# EAGLE design TinySoc (EAGLE 6.4)

## Sheet 1 of 2
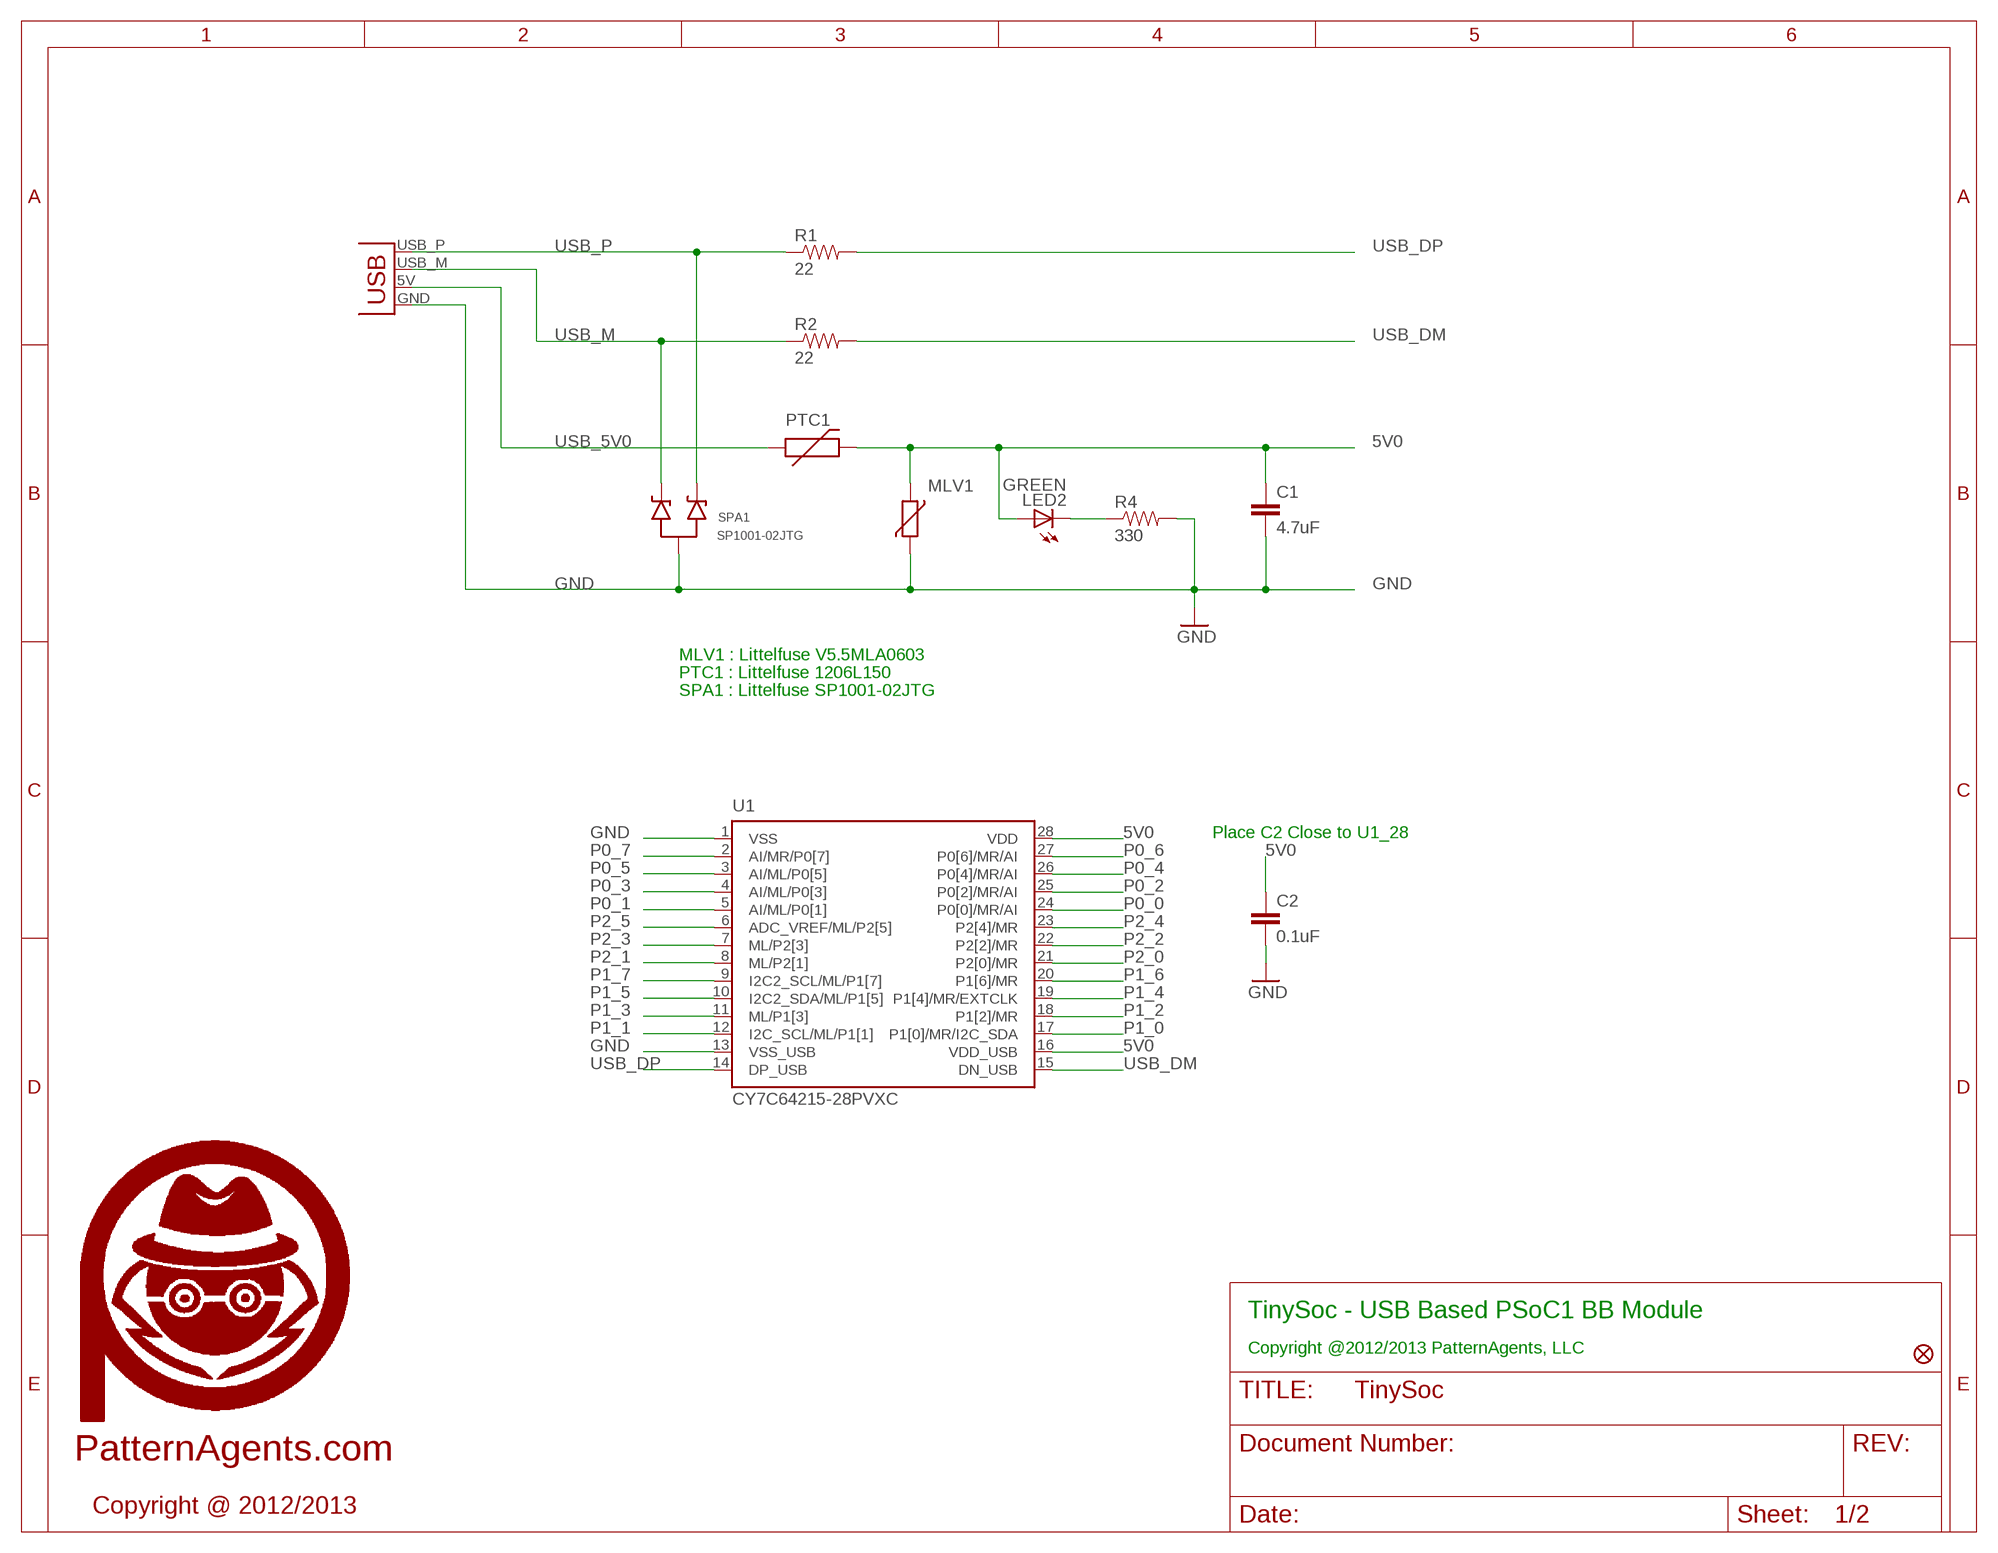
[diagram p0: schematic, sheet 1]

### Parts
C1  4.7uF  CAP0603-CAP  [0603-CAP]
C2  0.1uF  CAP0603-CAP  [0603-CAP]
FID1  FIDUCIAL1.5X3  [FIDUCIAL-1.5X3]
LED2  GREEN  LED0603  [LED-0603]
MLV1  VARISTORCN0603  [CT/CN0603]
PTC1  PTCSMD  [PTC-1206]
R1  22  RESISTOR0603-RES  [0603-RES]
R2  22  RESISTOR0603-RES  [0603-RES]
R4  330  RESISTOR0603-RES  [0603-RES]
SPA1  SP1001-02JTG  [SC70-3]
U1  CY7C64215-28PVXC  [SSOP28]
U$2  PA_LOGO_SYMSMALL  [PA_LOGO_AGENT_SMALL_SYM]
USBPCB  USBPCB  [USB-A-PCB]

### Nets
5V0: C1.1 C2.1 LED2.A MLV1.1 PTC1.2 U1.16(VDD_USB) U1.28(VDD) ; also sheet 2
GND: C1.2 C2.2 MLV1.2 R4.2 SPA1.3(A) U1.1(VSS) U1.13(VSS_USB) USBPCB.GND ; also sheet 2
N$1: LED2.C R4.1
P0_0: U1.24(P0[0]/MR/AI) ; also sheet 2
P0_1: U1.5(AI/ML/P0[1]) ; also sheet 2
P0_2: U1.25(P0[2]/MR/AI) ; also sheet 2
P0_3: U1.4(AI/ML/P0[3]) ; also sheet 2
P0_4: U1.26(P0[4]/MR/AI) ; also sheet 2
P0_5: U1.3(AI/ML/P0[5]) ; also sheet 2
P0_6: U1.27(P0[6]/MR/AI) ; also sheet 2
P0_7: U1.2(AI/MR/P0[7]) ; also sheet 2
P1_0: U1.17(P1[0]/MR/I2C_SDA) ; also sheet 2
P1_1: U1.12(I2C_SCL/ML/P1[1]) ; also sheet 2
P1_2: U1.18(P1[2]/MR) ; also sheet 2
P1_3: U1.11(ML/P1[3]) ; also sheet 2
P1_4: U1.19(P1[4]/MR/EXTCLK) ; also sheet 2
P1_5: U1.10(I2C2_SDA/ML/P1[5]) ; also sheet 2
P1_6: U1.20(P1[6]/MR) ; also sheet 2
P1_7: U1.9(I2C2_SCL/ML/P1[7]) ; also sheet 2
P2_0: U1.21(P2[0]/MR) ; also sheet 2
P2_1: U1.8(ML/P2[1]) ; also sheet 2
P2_2: U1.22(P2[2]/MR) ; also sheet 2
P2_3: U1.7(ML/P2[3]) ; also sheet 2
P2_4: U1.23(P2[4]/MR) ; also sheet 2
P2_5: U1.6(ADC_VREF/ML/P2[5]) ; also sheet 2
USB_5V0 [usbvcc]: PTC1.1 USBPCB.5V(VBUS)
USB_DM: R2.2 U1.15(DN_USB)
USB_DP: R1.2 U1.14(DP_USB)
USB_M: R2.1 SPA1.2(C2) USBPCB.USB_M(D-)
USB_P: R1.1 SPA1.1(C1) USBPCB.USB_P(D+)

### Notes on the sheet
- MLV1 : Littelfuse V5.5MLA0603
- PTC1 : Littelfuse 1206L150
- SPA1 : Littelfuse SP1001-02JTG
- Place C2 Close to U1_28
- TinySoc - USB Based PSoC1 BB Module
- Copyright @2012/2013 PatternAgents, LLC
- PatternAgents.com
- Copyright @ 2012/2013

## Sheet 2 of 2
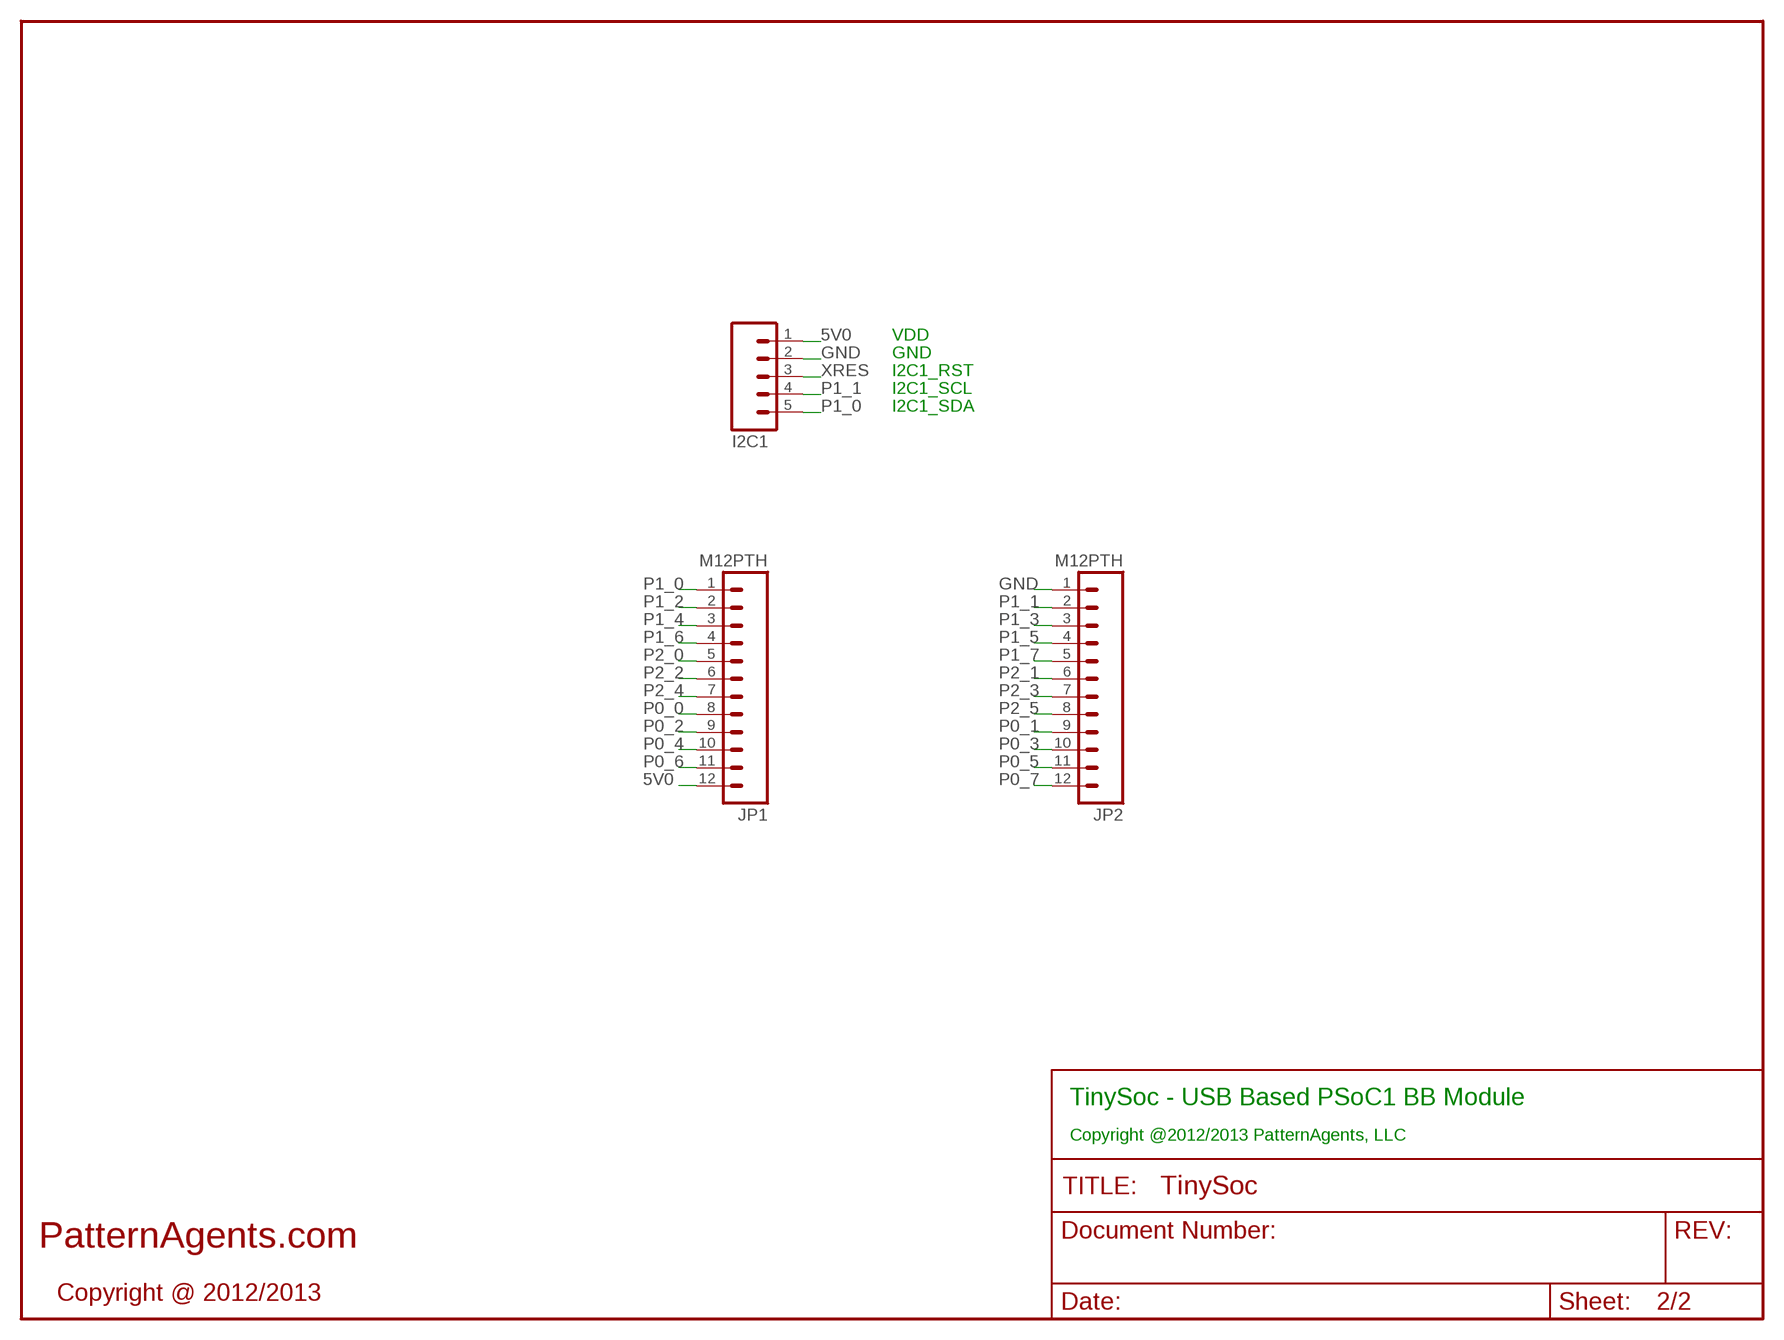
[diagram p1: schematic, sheet 2]

### Parts
I2C1  M05PTH  [1X05]
JP1  M12PTH  [1X12]
JP2  M12PTH  [1X12]

### Nets
5V0: I2C1.1 JP1.12 ; also sheet 1
GND: I2C1.2 JP2.1 ; also sheet 1
P0_0: JP1.8 ; also sheet 1
P0_1: JP2.9 ; also sheet 1
P0_2: JP1.9 ; also sheet 1
P0_3: JP2.10 ; also sheet 1
P0_4: JP1.10 ; also sheet 1
P0_5: JP2.11 ; also sheet 1
P0_6: JP1.11 ; also sheet 1
P0_7: JP2.12 ; also sheet 1
P1_0: I2C1.5 JP1.1 ; also sheet 1
P1_1: I2C1.4 JP2.2 ; also sheet 1
P1_2: JP1.2 ; also sheet 1
P1_3: JP2.3 ; also sheet 1
P1_4: JP1.3 ; also sheet 1
P1_5: JP2.4 ; also sheet 1
P1_6: JP1.4 ; also sheet 1
P1_7: JP2.5 ; also sheet 1
P2_0: JP1.5 ; also sheet 1
P2_1: JP2.6 ; also sheet 1
P2_2: JP1.6 ; also sheet 1
P2_3: JP2.7 ; also sheet 1
P2_4: JP1.7 ; also sheet 1
P2_5: JP2.8 ; also sheet 1
XRES: I2C1.3

### Notes on the sheet
- VDD
- GND
- I2C1_RST
- I2C1_SCL
- I2C1_SDA
- TinySoc - USB Based PSoC1 BB Module
- Copyright @2012/2013 PatternAgents, LLC
- PatternAgents.com
- Copyright @ 2012/2013

## Library data of the parts
C1 C2 = SparkFun:CAP: Capacitor Standard 0603 ceramic capacitor, and 0.1" leaded capacitor.
FID1 = PatternAgents-Misc:FIDUCIAL: Fiducial Alignment Points Various fiducial points for machine vision alignment.
I2C1 = SparkFun:M05: Header 5 Standard 5-pin 0.1" header. Use with straight break away headers (SKU : PRT-00116), right angle break away headers (PRT-00553), swiss pins (PRT-00743), machine pins (PRT-00117), and female headers (PRT-00115). Molex polarized connector foot print use with SKU : PRT-08230 with associated crimp pins and housings.
JP1 JP2 = SparkFun:M12: Header 12 Standard 12-pin 0.1" header. Use with straight break away headers (SKU : PRT-00116), right angle break away headers (PRT-00553), swiss pins (PRT-00743), machine pins (PRT-00117), and female headers (PRT-00115).
LED2 = SparkFun:LED: LEDs Standard schematic elements and footprints for 5mm, 3mm, 1206, and 0603 sized LEDs. 5mm - Spark Fun Electronics SKU : COM-00529 (and others)
MLV1 = moxdes_V1_0:VARISTOR: VARISTOR
PTC1 = moxdes_V1_0:PTC: Resettable Fuse PTC Resettable Fuse. Spark Fun Electronics SKU : COM-08357
R1 R2 R4 = SparkFun:RESISTOR: Resistor Basic schematic elements and footprints for 0603, 1206, and PTH resistors.
SPA1 = moxdes_V1_0:SP1001-02JTG: Littelfuse SP1001-02JTG TVS Diode Array 8pf 15kV Source: http://www.littelfuse.com/data/en/Product_Catalogs/Littelfuse_TVS_Diode_Array_SPA_Catalog.pdf patternshed.com: created 3/25/2012
U1 = moxdes_std:CY7C64215-28PVXC: EZ-USB ENCORE3 28SSOP
U$2 = PatternAgents-Logos:PA_LOGO_SYM: PatternAgents Logo Symbol Trademark : PatternAgents, LLC Github : https://github.com/PatternAgents/PCB_Libraries License : http://creativecommons.org/licenses/by-sa/3.0/ (Creative Commons 3.0) THIS SOFTWARE IS PROVIDED BY THE CONTRIBUTORS "AS IS" AND WITHOUT ANY EXPRESS OR IMPLIED WARRANTIES, INCLUDING, BUT NOT LIMITED TO, THE IMPLIED WARRANTIES OF MERCHANTABILITY AND FITNESS FOR A PARTICULAR PURPOSE ARE DISCLAIMED. IN NO EVENT SHALL THE COPYRIGHT OWNER OR CONTRIBUTORS BE LIABLE FOR ANY DIRECT, INDIRECT, INCIDENTAL, SPECIAL, EXEMPLARY, OR CONSEQUENTIAL DAMAGES (INCLUDING, BUT NOT LIMITED TO, PROCUREMENT OF SUBSTITUTE GOODS OR SERVICES; LOSS OF USE, DATA, OR PROFITS; OR BUSINESS INTERRUPTION) HOWEVER CAUSED AND ON ANY THEORY OF LIABILITY, WHETHER IN CONTRACT, STRICT LIABILITY, OR TORT (INCLUDING NEGLIGENCE OR OTHERWISE) ARISING IN ANY WAY OUT OF THE USE OF THIS SOFTWARE, EVEN IF ADVISED OF THE POSSIBILITY OF SUCH DAMAGE.
USBPCB = SparkFun:USB: USB Connectors USB-B-PTH is fully proven SKU : PRT-00139 USB-miniB is fully proven SKU : PRT-00587 USB-A-PCB is untested. USB-A-H is throughly reviewed, but untested. Spark Fun Electronics SKU : PRT-00437 USB-B-SMT is throughly reviewed, but untested. Needs silkscreen touching up. USB-A-S has not been used/tested USB-MB-H has not been used/tested

## Net classes
0 default: width 0.254 mm, clearance 0.254 mm
1 power: width 0.61 mm, drill 0.61 mm, clearance 0.254 mm
2 gnd: width 0.305 mm, drill 0.559 mm, clearance 0.254 mm
3 usbvcc: width 0.508 mm, drill 0.61 mm, clearance 0.254 mm

## Board
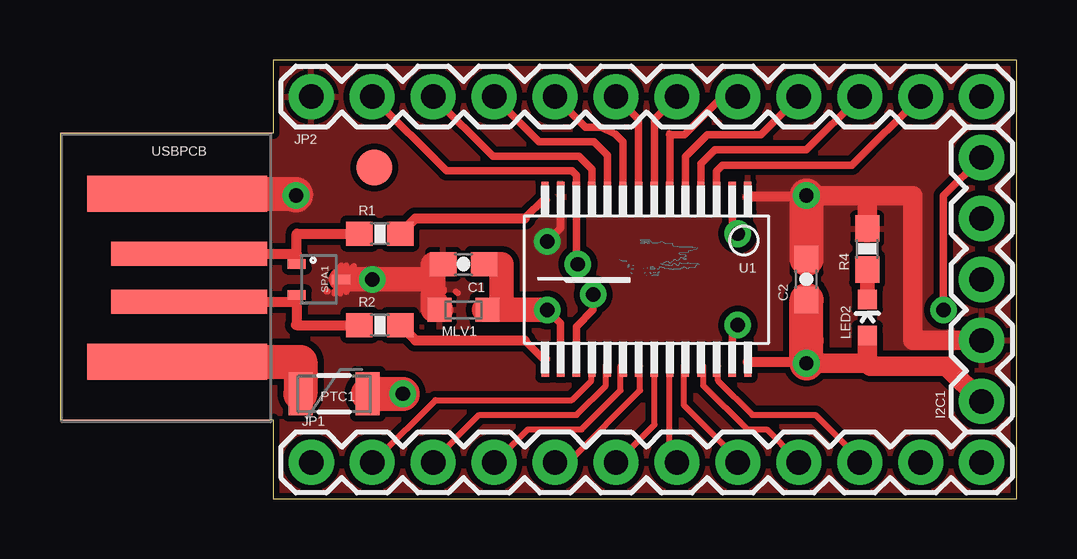
[diagram p2: board, top side]
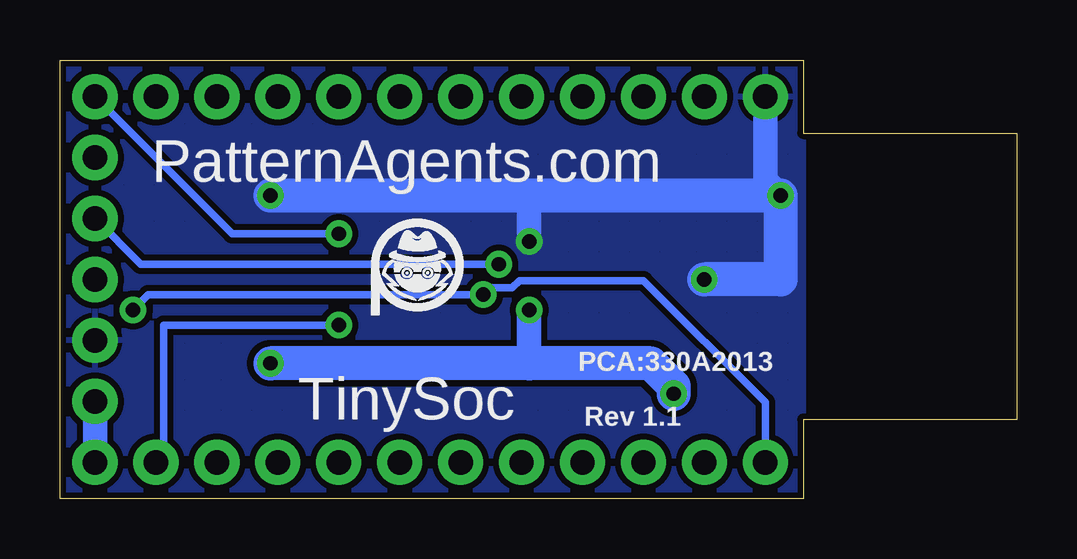
[diagram p3: board, bottom side, seen from below]

Size 39.88 x 18.29 mm. Coordinates in mm from the lower left corner, seen from the top.
Outline: 0,15.24 0,3.3 8.89,3.3 8.89,0 39.88,0 39.88,18.29 8.89,18.29 8.89,15.24 0,15.24
Copper layers (1*16): Top 0.035mm / dielectric 1.5mm / Bottom 0.035mm
Design rules "PatternAgents": minimum track width 8mil, minimum drill 14mil, track to track 8mil, track to pad 8mil, pad to pad 8mil, via to via 8mil, smd to smd 8mil, copper to edge 10mil, drill to drill 8mil, minimum pad ring 12mil, minimum via ring 10mil, stop-mask expansion 4mil, vias tented up to drill 25mil, thermal gap 8mil

### Footprints (pad centres in the part's own frame; a part is rotated, then mirrored left to right if it is on the bottom)
0603-CAP = smd 1.1 x 1: 1 -0.85,0; 2 0.85,0
FIDUCIAL-1.5X3 = smd 1.5 x 1.5: 1 0,0
1X05 = drill 1.016 pad 1.88: 1 0,0; 2 2.54,0; 3 5.08,0; 4 7.62,0; 5 10.16,0
1X12 = drill 1.016 pad 1.88: 1 0,0; 2 2.54,0; 3 5.08,0; 4 7.62,0; 5 10.16,0; 6 12.7,0; 7 15.24,0; 8 17.78,0; 9 20.32,0; 10 22.86,0; 11 25.4,0; 12 27.94,0
LED-0603 = smd 0.8 x 0.8: A 0,-0.75; C 0,0.75
CT/CN0603 = smd 1 x 1: 1 -1,0; 2 1,0
PTC-1206 = smd 1 x 1.8: 1 -1.4,0; 2 1.4,0
0603-RES = smd 1.1 x 1: 1 -0.85,0; 2 0.85,0
SC70-3 = smd 0.4 x 0.75: 1 -0.65,-0.925; 2 0.65,-0.925; 3 0,0.925
SSOP28 = smd 0.305 x 1.245: 1 4.224,3.441; 2 3.574,3.441; 3 2.924,3.441; 4 2.274,3.441; 5 1.624,3.441; 6 0.974,3.441; 7 0.325,3.44; 8 -0.326,3.441; 9 -0.976,3.441; 10 -1.626,3.441; 11 -2.276,3.441; 12 -2.926,3.441; 13 -3.576,3.441; 14 -4.226,3.441; 15 -4.224,-3.441; 16 -3.574,-3.441; 17 -2.924,-3.441; 18 -2.274,-3.441; 19 -1.624,-3.441; 20 -0.974,-3.441; 21 -0.324,-3.441; 22 0.326,-3.441; 23 0.976,-3.441; 24 1.626,-3.441; 25 2.276,-3.441; 26 2.926,-3.441; 27 3.576,-3.441; 28 4.226,-3.441
USB-A-PCB = smd 7.5 x 1.5: 5V -0.2,-3.5; GND -0.2,3.5 | smd 6.5 x 1: USB_M 0.3,-1; USB_P 0.3,1

### Placement (x,y rotation side)
C1  16.83,9.78 180 top
C2  31.11,9.14 90 top
FID1  13.11,13.82 0 top
I2C1  38.42,4.06 90 top
JP1  10.48,1.52 0 top
JP2  10.48,16.76 0 top
LED2  33.66,7.56 0 top
MLV1  16.83,7.87 180 top
PTC1  11.43,4.38 0 top
R1  13.34,11.05 0 top
R2  13.34,7.24 0 top
R4  33.66,10.41 90 top
SPA1  10.79,9.14 270 top
U1  24.45,9.14 0 top
U$2  24.99,9.4 0 bottom
USBPCB  5.08,9.21 0 top

### Tracks (layer width: path | path; a pad name or v marks a point on that pad's centre or on a via)
5V0  (via drill 0.6)
  Top 0.305: U1.16 20.87,7.32 v20.32,7.87
  Top 0.406: U1.28 31.06,5.7 v31.11,5.65
  Top 0.61: 31.11,6.6 31.32,6.81
  Top 0.813: C1.1 17.83,9.78 | v31.11,5.65 33.66,5.65 | 33.66,5.65 LED2.A | 33.66,5.65 33.78,5.53 36.96,5.53 I2C1.1
  Top 1.016: 17.68,7.87 MLV1.1 18.41,7.87 | C1.1 18.41,9.78 18.41,7.87 | v20.32,7.87 18.41,7.87
  Top 1.422: PTC1.2 v14.29,4.38 | v31.11,5.65 31.11,6.6 C2.1
  Bottom 1.016: 20.32,5.65 v20.32,7.87 | I2C1.1 JP1.12
  Bottom 1.422: v14.29,4.38 14.29,4.7 15.24,5.65 20.32,5.65 v31.11,5.65
GND  (via drill 0.6)
  Top 0.254: 15.75,7.87 15.75,8 | 11.68,9.4 11.72,9.4 | 11.43,8.64 11.43,8.56 | 11.68,8.64 11.68,8.56 | 11.68,9.65 11.72,9.72 | 13.21,9.4 v13.02,9.14 | 16,9.65 C1.2 15.75,9.65 15.85,9.66 | 16.26,7.87 MLV1.2 16,8.13 15.95,8.13 | 12.95,9.4 v13.02,9.14 | 11.94,9.65 11.94,9.72 | 12.7,9.4 v13.02,9.14 | 16,8.38 15.95,8.38 | 11.18,8.64 11.11,8.64 | 15.75,9.14 15.85,9.14 | 16,8.64 16,8.75 | 12.19,9.65 12.24,9.7 | 11.94,8.64 11.94,8.61 | 11.68,8.89 11.72,8.89 | 11.68,9.14 SPA1.3 | 16.51,8.64 16.59,8.58
  Top 0.305: U1.13 20.87,11.28 v20.32,10.73
  Top 0.406: U1.1 30.75,12.58 v31.11,12.64
  Top 0.61: C1.2 15.83,9.78 | 31.11,11.37 31.22,11.26
  Top 0.813: I2C1.2 35.56,6.6 35.56,12.64 33.66,12.64 | v31.11,12.64 33.66,12.64 | 33.66,12.64 33.66,11.37
  Top 1.016: SPA1.3 v13.02,9.14 15.56,9.14 | 15.88,7.87 MLV1.2 15.75,7.87 15.56,7.87 15.56,9.14 | 15.56,9.14 15.56,9.78 C1.2 | 33.66,11.37 R4.2
  Top 1.422: USBPCB.GND 9.84,12.71 v9.84,12.64 | v31.11,12.64 31.11,11.37 C2.2
  Bottom 1.016: 20.32,12.64 v20.32,10.73 | JP2.1 10.48,13.27 v9.84,12.64
  Bottom 1.422: v31.11,12.64 20.32,12.64 v9.84,12.64 9.84,9.14 v13.02,9.14
  pour Bottom (isolate 0.254, hatched): 8.89,0.25 8.89,18.03 39.69,18.03 39.69,0.25
  pour Top (isolate 0.254): 8.89,18.03 8.89,0.25 39.62,0.25 39.62,18.03
N$1
  Top 0.61: R4.1 LED2.C
P0_0
  Top 0.254: U1.24 26.01,5.54 26.01,3.91 28.25,1.68 JP1.8
P0_1
  Top 0.305: U1.5 26.07,14.26 26.99,15.18 29.21,15.18 JP2.9
P0_2
  Top 0.254: U1.25 26.82,5.54 26.82,4.72 28.65,2.9 29.46,2.9 30.68,1.68 JP1.9
P0_3
  Top 0.305: U1.4 26.72,13.96 27.3,14.54 31.11,14.54 JP2.10
P0_4
  Top 0.254: U1.26 27.43,5.54 27.43,4.93 28.85,3.5 31.5,3.5 33.33,1.68 JP1.10
P0_5
  Top 0.305: U1.3 27.37,13.65 27.62,13.91 33.02,13.91 JP2.11
P0_6  (via drill 0.6)
  Top 0.305: U1.27 28.02,7.01 v28.26,7.24
  Bottom 0.305: v28.26,7.24 35.56,7.24 35.56,1.84 JP1.11
P0_7  (via drill 0.6)
  Top 0.305: U1.2 28.02,11.29 v28.26,11.05
  Bottom 0.305: v28.26,11.05 32.7,11.05 JP2.12
P1_0  (via drill 0.6)
  Top 0.305: U1.17 21.52,7.17 22.23,7.87 v22.23,8.51 | v36.83,7.87 36.83,12.64 I2C1.5
  Bottom 0.305: v22.23,8.51 36.2,8.51 v36.83,7.87 | JP1.1 10.48,4.03 15.54,9.09 20.73,9.09 21.03,8.79 21.95,8.79 v22.23,8.51 | v22.23,8.51 22.2,8.48
P1_1  (via drill 0.6)
  Top 0.305: v21.59,9.78 21.52,9.85 U1.12 21.52,13.48 21.34,13.66 16.12,13.66 JP2.2
  Bottom 0.305: v21.59,9.78 36.51,9.78 I2C1.4
P1_2
  Top 0.254: U1.18 22.15,5.54 22.15,4.93 21.34,4.12 15.65,4.12 13.21,1.68 JP1.2
P1_3
  Top 0.305: U1.11 22.17,13.74 21.64,14.28 18.05,14.28 JP2.3
P1_4
  Top 0.254: U1.19 22.76,5.54 22.76,4.72 21.54,3.5 17.48,3.5 15.65,1.68 JP1.3
P1_5
  Top 0.305: U1.10 22.82,14.31 22.25,14.88 19.98,14.88 JP2.4
P1_6
  Top 0.254: U1.20 23.37,5.54 23.37,4.52 21.74,2.9 19.51,2.9 18.29,1.68 JP1.4
P1_7
  Top 0.305: U1.9 23.47,14.88 23.16,15.19 22.55,15.49 21.91,15.49 JP2.5
P2_0
  Top 0.254: U1.21 24.18,5.54 24.18,4.52 21.34,1.68 20.73,1.68 JP1.5
P2_1
  Top 0.305: U1.8 24.12,15.82 JP2.6
P2_2
  Top 0.254: U1.22 24.79,5.54 24.79,3.1 23.37,1.68 JP1.6
P2_3
  Top 0.305: U1.7 24.77,15.82 JP2.7
P2_4
  Top 0.254: U1.23 25.4,5.54 25.4,1.88 25.6,1.68 JP1.7
P2_5
  Top 0.254: 25.42,15.15 25.4,15.24 25.4,15.18
  Top 0.305: U1.6 25.42,15.15 | 25.4,15.18 26.04,15.18 27.62,16.76 JP2.8
USB_5V0
  Top 1.422: USBPCB.5V 10.03,5.71 PTC1.1
USB_DM
  Top 0.254: U1.15 20.32,5.84 20.22,5.75
  Top 0.305: 19.37,6.6 20.22,5.75
  Top 0.406: 19.37,6.6 14.82,6.6 R2.2
USB_DP
  Top 0.254: U1.14 20.32,12.45 20.22,12.54
  Top 0.305: 19.37,11.68 20.22,12.54
  Top 0.406: 19.37,11.68 14.82,11.68 R1.2
USB_M
  Top 0.406: USBPCB.USB_M 9.87,8.21 SPA1.2 9.87,7.24 | 9.87,7.24 R2.1 | 9.87,7.24 9.84,7.24
USB_P
  Top 0.406: USBPCB.USB_P 9.87,10.21 SPA1.1 9.87,11.05 R1.1

### Text on the board
bPlace: PatternAgents.com | PCA:330A2013 | Rev 1.1 | TinySoc